# EAGLE design CANcape (EAGLE 7.7.0)
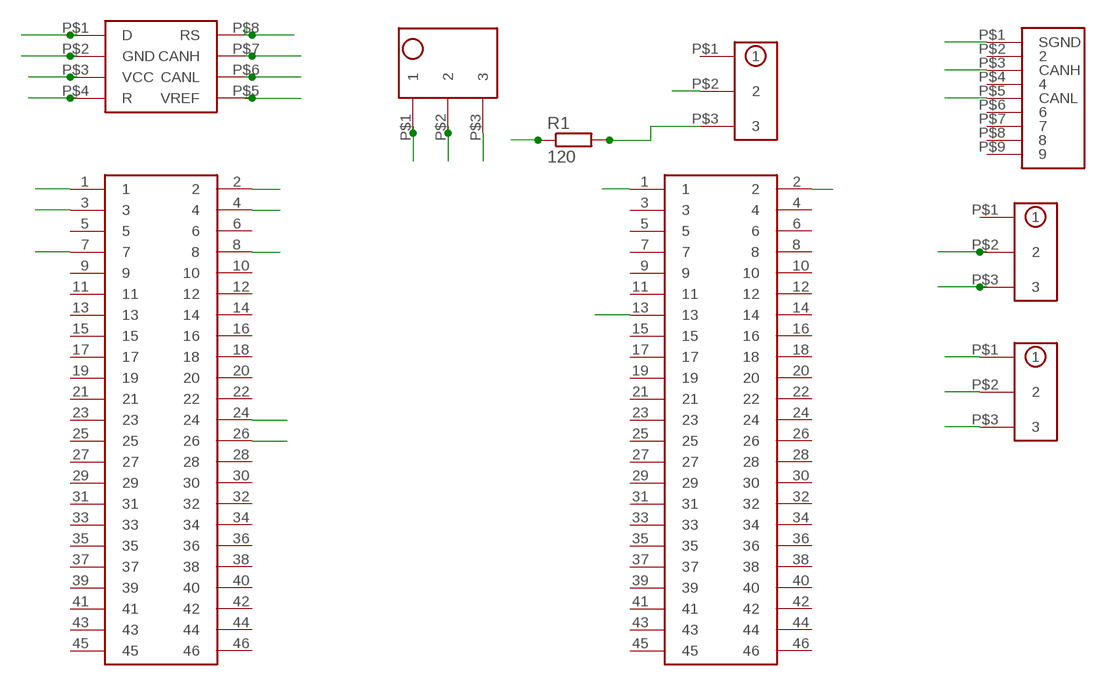
[diagram p0: schematic, sheet 1]

## Parts
R1  120  R-EU_0207/15  [0207/15]
U$1  2X23_STACKABLE_HEADERS  [2X23_STACKABLE-HEADERS]
U$2  2X23_STACKABLE_HEADERS  [2X23_STACKABLE-HEADERS]
U$3  TB-5.0-PT-3P  [TB-5.0-PT-3P]
U$4  1X3_HEADER  [1X3_HEADER]
U$5  SOIC_BREAKOUT  [SOIC_BREAKOUT]
U$6  DB9_BREAKOUT  [DB9_BREAKOUT]
U$7  1X3_HEADER  [1X3_HEADER]
U$8  1X3_HEADER  [1X3_HEADER]

## Nets
3.3V: U$1.3 U$1.4 U$5.P$5(VREF) U$8.P$1
5V: U$1.7 U$1.8 U$8.P$3
CANH: U$3.P$1 U$4.P$2 U$5.P$7(CANH) U$6.P$3(CANH)
CANL: R1.1 U$3.P$2 U$5.P$6(CANL) U$6.P$5(CANL)
DCAN1_RX: U$1.24 U$5.P$4(R)
DCAN1_TX: U$1.26 U$5.P$1(D)
GND: U$1.1 U$1.2 U$2.1 U$2.2 U$5.P$2(GND) U$7.P$3
N$1: R1.2 U$4.P$3
SGND: U$3.P$3 U$6.P$1(SGND) U$7.P$2
STANDBY: U$2.13 U$5.P$8(RS)
TRAN_PWR: U$5.P$3(VCC) U$8.P$2
Unconnected: U$1.5 U$1.6 U$1.9 U$1.10 U$1.11 U$1.12 U$1.13 U$1.14 U$1.15 U$1.16 U$1.17 U$1.18 U$1.19 U$1.20 U$1.21 U$1.22 U$1.23 U$1.25 U$1.27 U$1.28 U$1.29 U$1.30 U$1.31 U$1.32 U$1.33 U$1.34 U$1.35 U$1.36 U$1.37 U$1.38 U$1.39 U$1.40 U$1.41 U$1.42 U$1.43 U$1.44 U$1.45 U$1.46 U$2.3 U$2.4 U$2.5 U$2.6 U$2.7 U$2.8 U$2.9 U$2.10 U$2.11 U$2.12 U$2.14 U$2.15 U$2.16 U$2.17 U$2.18 U$2.19 U$2.20 U$2.21 U$2.22 U$2.23 U$2.24 U$2.25 U$2.26 U$2.27 U$2.28 U$2.29 U$2.30 U$2.31 U$2.32 U$2.33 U$2.34 U$2.35 U$2.36 U$2.37 U$2.38 U$2.39 U$2.40 U$2.41 U$2.42 U$2.43 U$2.44 U$2.45 U$2.46 U$4.P$1 U$6.P$2 U$6.P$4 U$6.P$6 U$6.P$7 U$6.P$8 U$6.P$9 U$7.P$1

## Library data of the parts
R1 = resistor:R-EU_: RESISTOR, European symbol
U$1 U$2 = CANcape:2X23_STACKABLE_HEADERS
U$3 = CANcape:TB-5.0-PT-3P
U$4 U$7 U$8 = CANcape:1X3_HEADER
U$5 = CANcape:SOIC_BREAKOUT
U$6 = CANcape:DB9_BREAKOUT

## Board
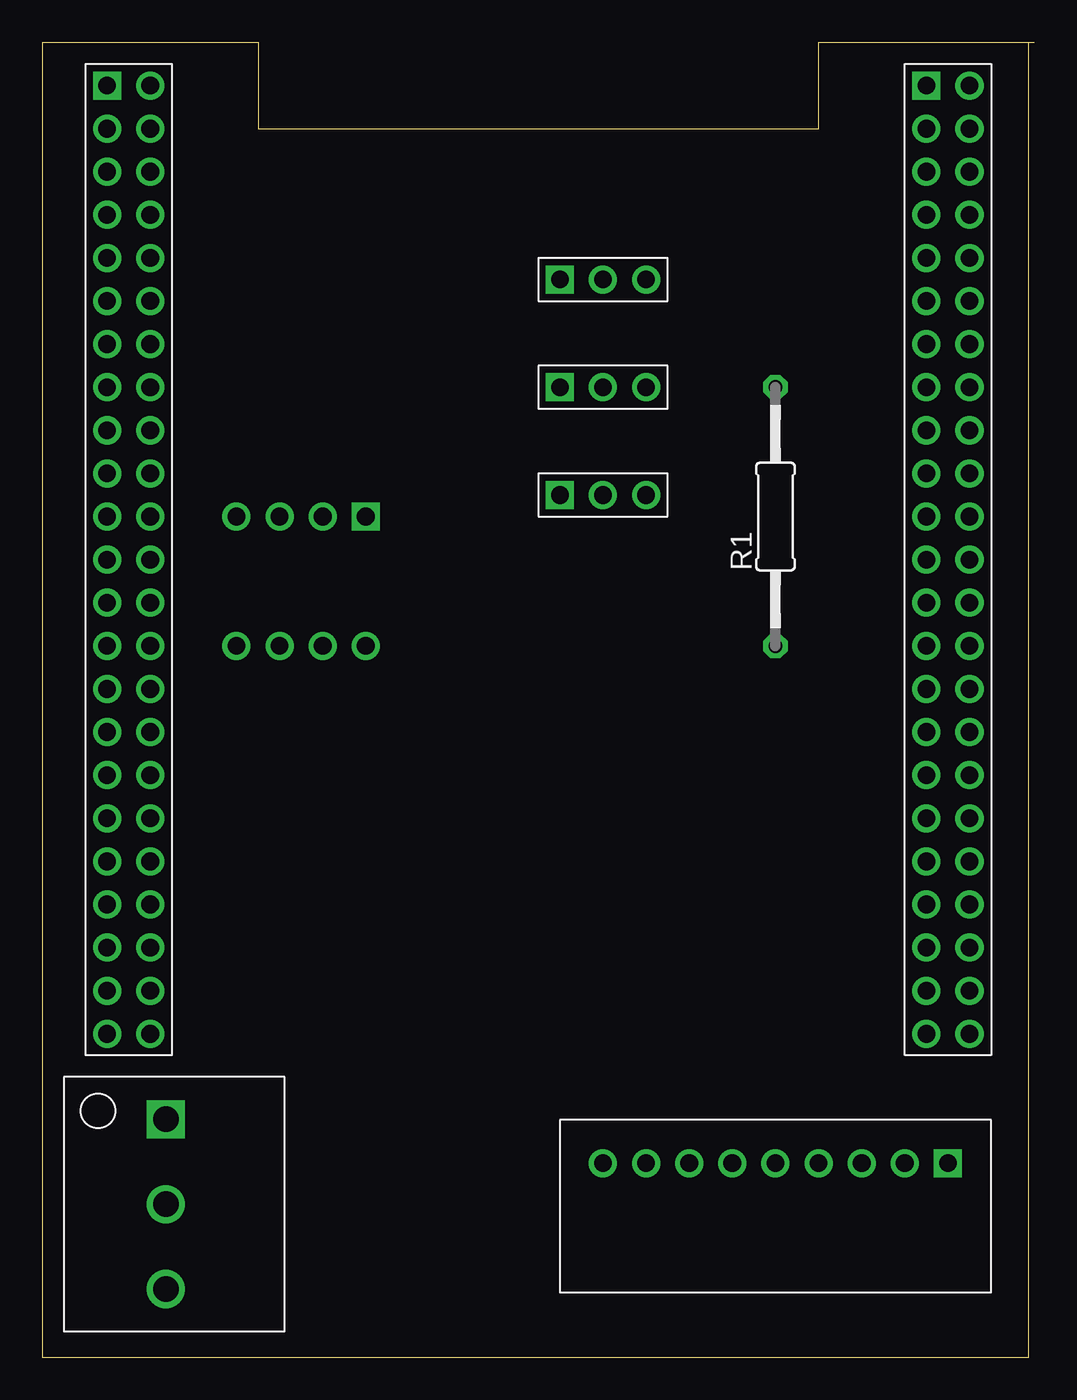
[diagram p1: board, top side]
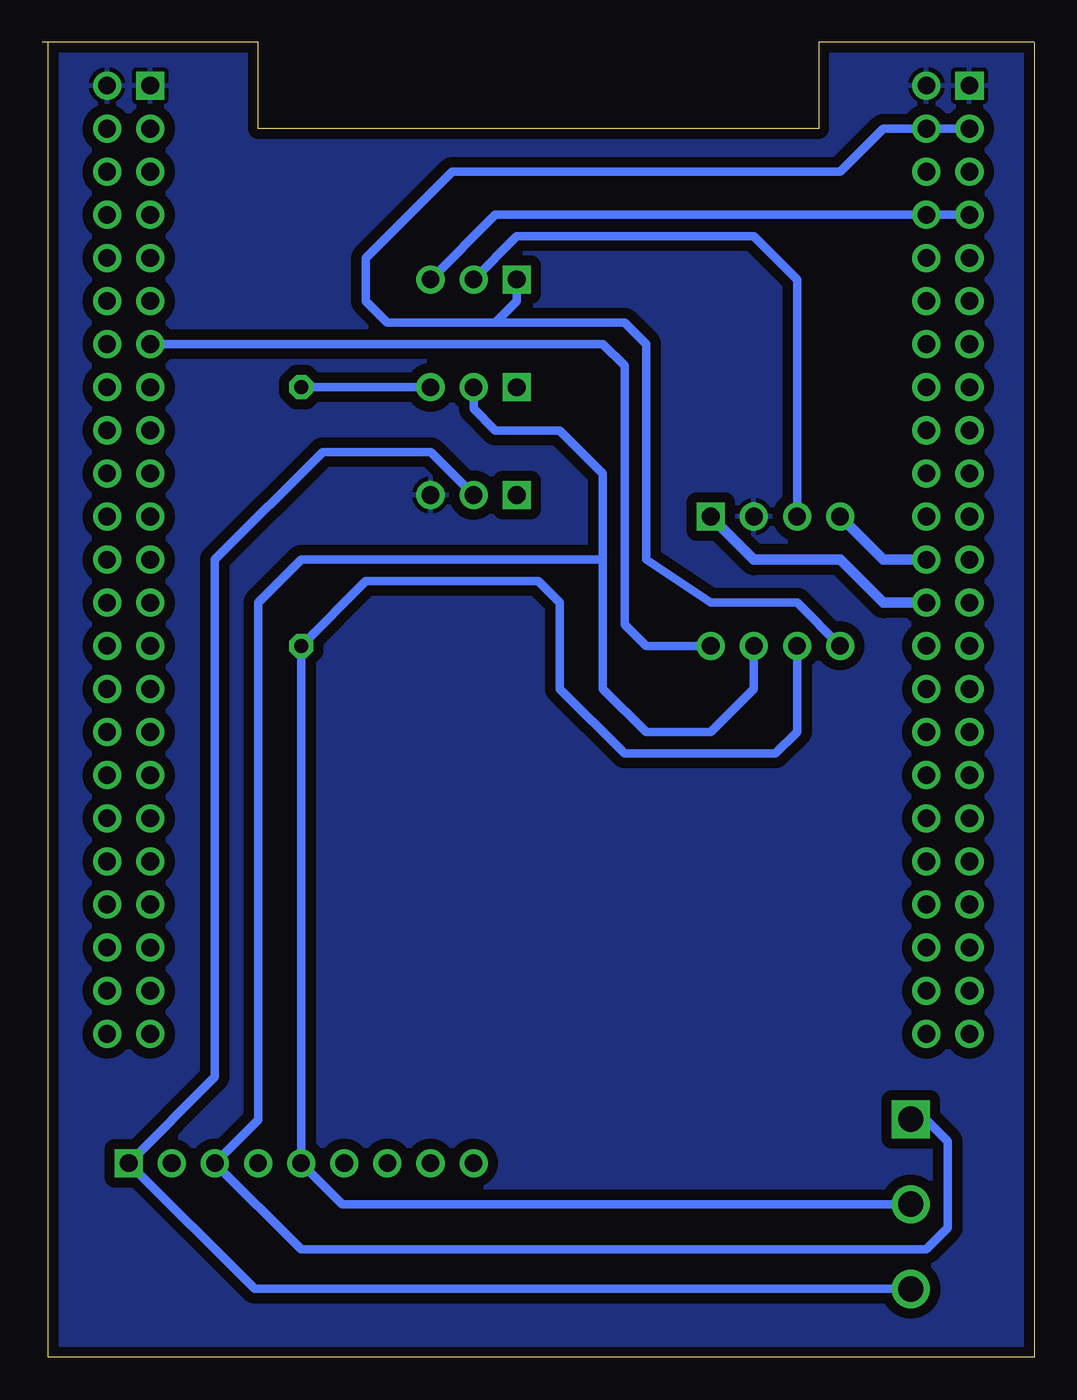
[diagram p2: board, bottom side, seen from below]

Size 58.42 x 77.47 mm. Coordinates in mm from the lower left corner, seen from the top.
Outline: 58.09,77.46 58.09,0 0,0 0,77.46
Outline: 0,77.47 12.7,77.47 12.7,72.39 45.72,72.39 45.72,77.47 58.42,77.47
Copper layers (1*16): Top 0.035mm / dielectric 1.5mm / Bottom 0.035mm
Design rules "SparkFun": minimum track width 8mil, minimum drill 20mil, track to track 8mil, track to pad 8mil, pad to pad 8mil, via to via 8mil, smd to smd 8mil, copper to edge 10mil, drill to drill 8mil, minimum pad ring 12mil, minimum via ring 10mil, stop-mask expansion 4mil, vias tented up to drill 25mil, thermal gap 10mil

### Footprints (pad centres in the part's own frame; a part is rotated, then mirrored left to right if it is on the bottom)
0207/15 = drill 0.813 octagon: 1 -7.62,0; 2 7.62,0
2X23_STACKABLE-HEADERS = drill 1.041 square: 1 0,0 | drill 1.041: 2 2.54,0; 3 0,-2.54; 4 2.54,-2.54; 5 0,-5.08; 6 2.54,-5.08; 7 0,-7.62; 8 2.54,-7.62; 9 0,-10.16; 10 2.54,-10.16; 11 0,-12.7; 12 2.54,-12.7; 13 0,-15.24; 14 2.54,-15.24; 15 0,-17.78; 16 2.54,-17.78; 17 0,-20.32; 18 2.54,-20.32; 19 0,-22.86; 20 2.54,-22.86; 21 0,-25.4; 22 2.54,-25.4; 23 0,-27.94; 24 2.54,-27.94; 25 0,-30.48; 26 2.54,-30.48; 27 0,-33.02; 28 2.54,-33.02; 29 0,-35.56; 30 2.54,-35.56; 31 0,-38.1; 32 2.54,-38.1; 33 0,-40.64; 34 2.54,-40.64; 35 0,-43.18; 36 2.54,-43.18; 37 0,-45.72; 38 2.54,-45.72; 39 0,-48.26; 40 2.54,-48.26; 41 0,-50.8; 42 2.54,-50.8; 43 0,-53.34; 44 2.54,-53.34; 45 0,-55.88; 46 2.54,-55.88
TB-5.0-PT-3P = drill 1.5 square: P$1 2.5,6 | drill 1.5: P$2 7.5,6; P$3 12.5,6
1X3_HEADER = drill 1.041 square: P$1 -2.54,0 | drill 1.041: P$2 0,0; P$3 2.54,0
SOIC_BREAKOUT = drill 1.041 square: P$1 -3.81,3.81 | drill 1.041: P$2 -3.81,1.27; P$3 -3.81,-1.27; P$4 -3.81,-3.81; P$5 3.81,-3.81; P$6 3.81,-1.27; P$7 3.81,1.27; P$8 3.81,3.81
DB9_BREAKOUT = drill 1.041 square: P$1 0,0 | drill 1.041: P$2 2.54,0; P$3 5.08,0; P$4 7.62,0; P$5 10.16,0; P$6 12.7,0; P$7 15.24,0; P$8 17.78,0; P$9 20.32,0

### Placement (x,y rotation side)
R1  43.18,49.53 90 top
U$1  3.81,74.93 0 top
U$2  52.07,74.93 0 top
U$3  1.27,16.51 270 top
U$4  33.02,57.15 0 top
U$5  15.24,45.72 270 top
U$6  53.34,11.43 180 top
U$7  33.02,50.8 0 top
U$8  33.02,63.5 0 top

### Tracks (layer width: path | path; a pad name or v marks a point on that pad's centre or on a via)
3.3V
  Bottom 0.508: U$1.3 U$1.4 8.89,72.39 11.43,69.85 34.29,69.85 39.37,64.77 39.37,62.23 38.1,60.96 31.75,60.96 | 31.75,60.96 30.48,62.23 U$8.P$1 | 31.75,60.96 24.13,60.96 22.86,59.69 22.86,46.99 19.05,44.45 13.97,44.45 U$5.P$5
5V
  Bottom 0.508: U$1.7 U$1.8 31.75,67.31 U$8.P$3
CANH
  Bottom 0.508: U$4.P$2 33.02,55.88 31.75,54.61 27.94,54.61 25.4,52.07 25.4,46.99 | 25.4,46.99 43.18,46.99 45.72,44.45 45.72,13.97 U$6.P$3 43.18,6.35 6.35,6.35 5.08,7.62 5.08,12.7 6.39,14.01 U$3.P$1 | 25.4,46.99 25.4,39.37 22.86,36.83 19.05,36.83 16.51,39.37 U$5.P$7
CANL
  Bottom 0.508: U$3.P$2 40.76,9.01 U$6.P$5 R1.1 39.37,45.72 29.21,45.72 27.94,44.45 27.94,39.37 24.13,35.56 15.24,35.56 13.97,36.83 U$5.P$6
DCAN1_RX
  Bottom 0.61: U$1.24 8.89,46.99 U$5.P$4
DCAN1_TX
  Bottom 0.61: U$1.26 8.89,44.45 11.43,46.99 16.51,46.99 U$5.P$1
GND
  pour Bottom (isolate 0.61): 0,77.47 12.7,77.47 12.7,72.39 45.72,72.39 45.72,77.47 58.42,77.47 58.42,0 0,0
N$1
  Bottom 0.508: U$4.P$3 R1.2
SGND
  Bottom 0.508: U$3.P$3 45.92,4.01 U$6.P$1 48.26,16.51 48.26,46.99 41.91,53.34 35.56,53.34 U$7.P$2
STANDBY
  Bottom 0.508: U$2.13 25.4,59.69 24.13,58.42 24.13,43.18 22.86,41.91 U$5.P$8
TRAN_PWR
  Bottom 0.508: U$8.P$2 30.48,66.04 16.51,66.04 13.97,63.5 U$5.P$3